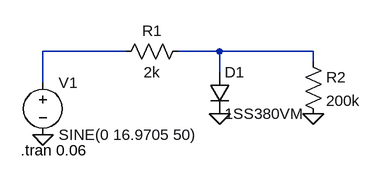
[diagram p0: schematic Positive Clipper.asc]
Positive Clipper.asc, the LTspice schematic file:
Version 4
SHEET 1 880 680
WIRE 80 96 -48 96
WIRE 224 96 160 96
WIRE 368 96 224 96
WIRE 368 112 368 96
WIRE 224 128 224 96
WIRE -48 144 -48 96
FLAG 368 192 0
FLAG 224 192 0
FLAG -48 224 0
SYMBOL res 176 80 R90
WINDOW 0 0 56 VBottom 2
WINDOW 3 32 56 VTop 2
SYMATTR InstName R1
SYMATTR Value 2k
SYMBOL diode 208 128 R0
SYMATTR InstName D1
SYMATTR Value 1SS380VM
SYMBOL res 352 96 R0
SYMATTR InstName R2
SYMATTR Value 200k
SYMBOL voltage -48 128 R0
WINDOW 123 0 0 Left 0
WINDOW 39 0 0 Left 0
SYMATTR InstName V1
SYMATTR Value SINE(0 16.9705 50)
TEXT -82 248 Left 2 !.tran 0.06

The netlist it stands for:
* Positive Clipper.asc
R1 N002 N001 2k
D1 N002 0 1SS380VM
R2 N002 0 200k
V1 N001 0 SINE(0 16.9705 50)
.model D D
.lib standard.dio
.tran 0.06
.backanno
.end